# Altium project PWR_MOSFET.PrjPcb
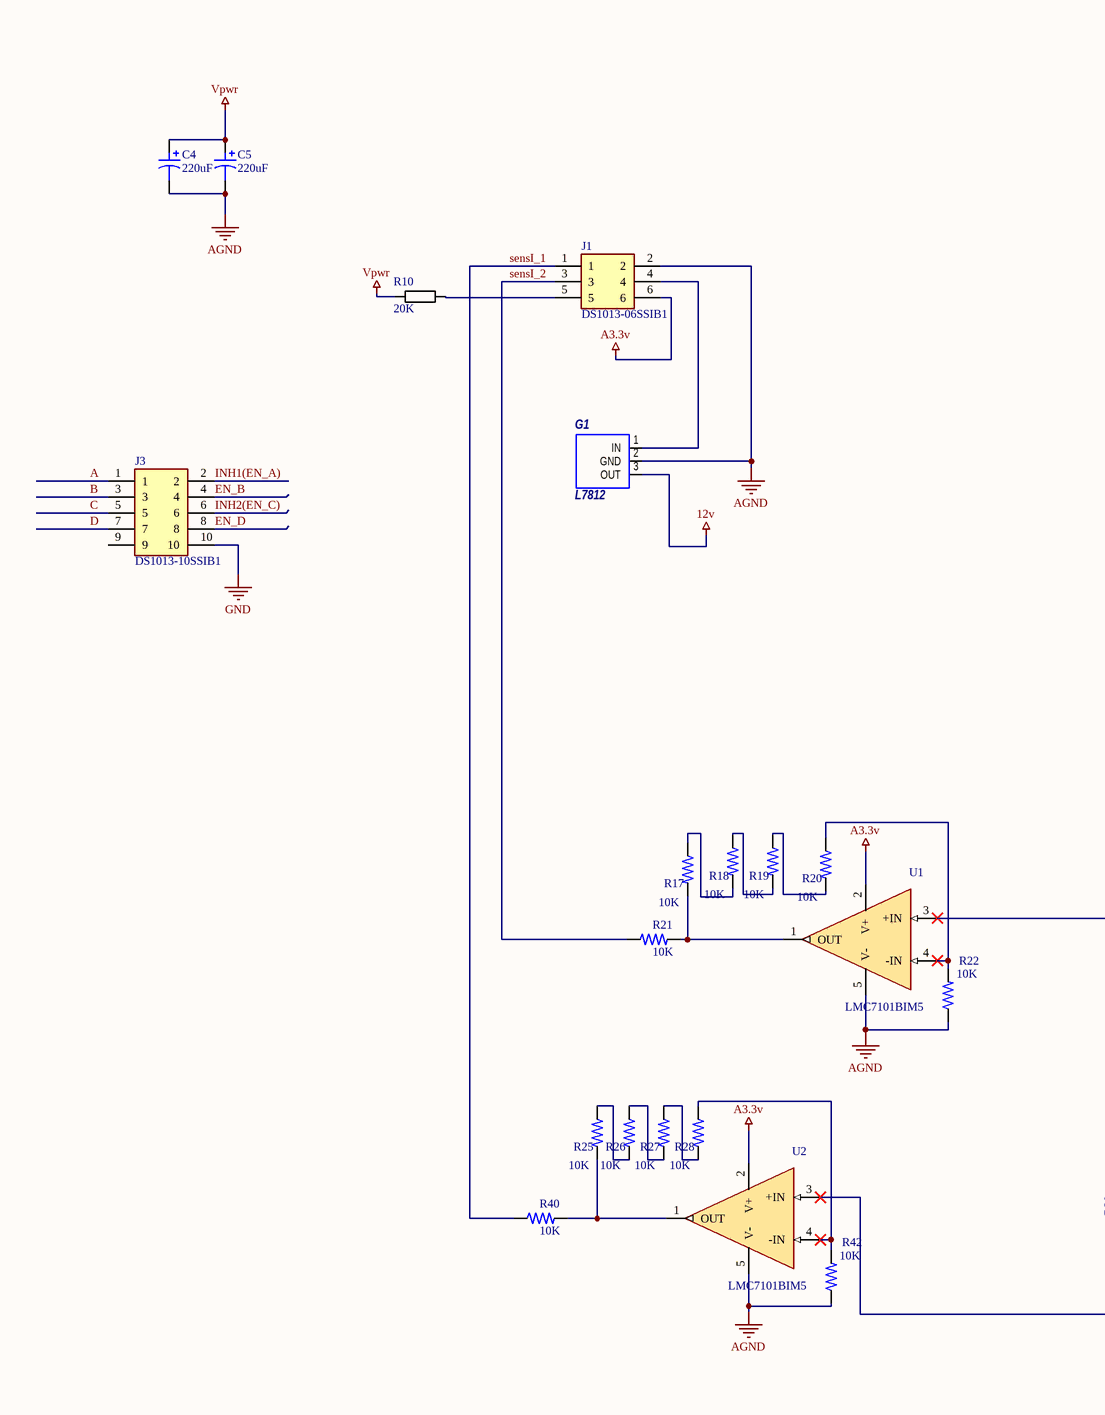
[diagram p0: PWR_MOSFET.SchDoc, left]
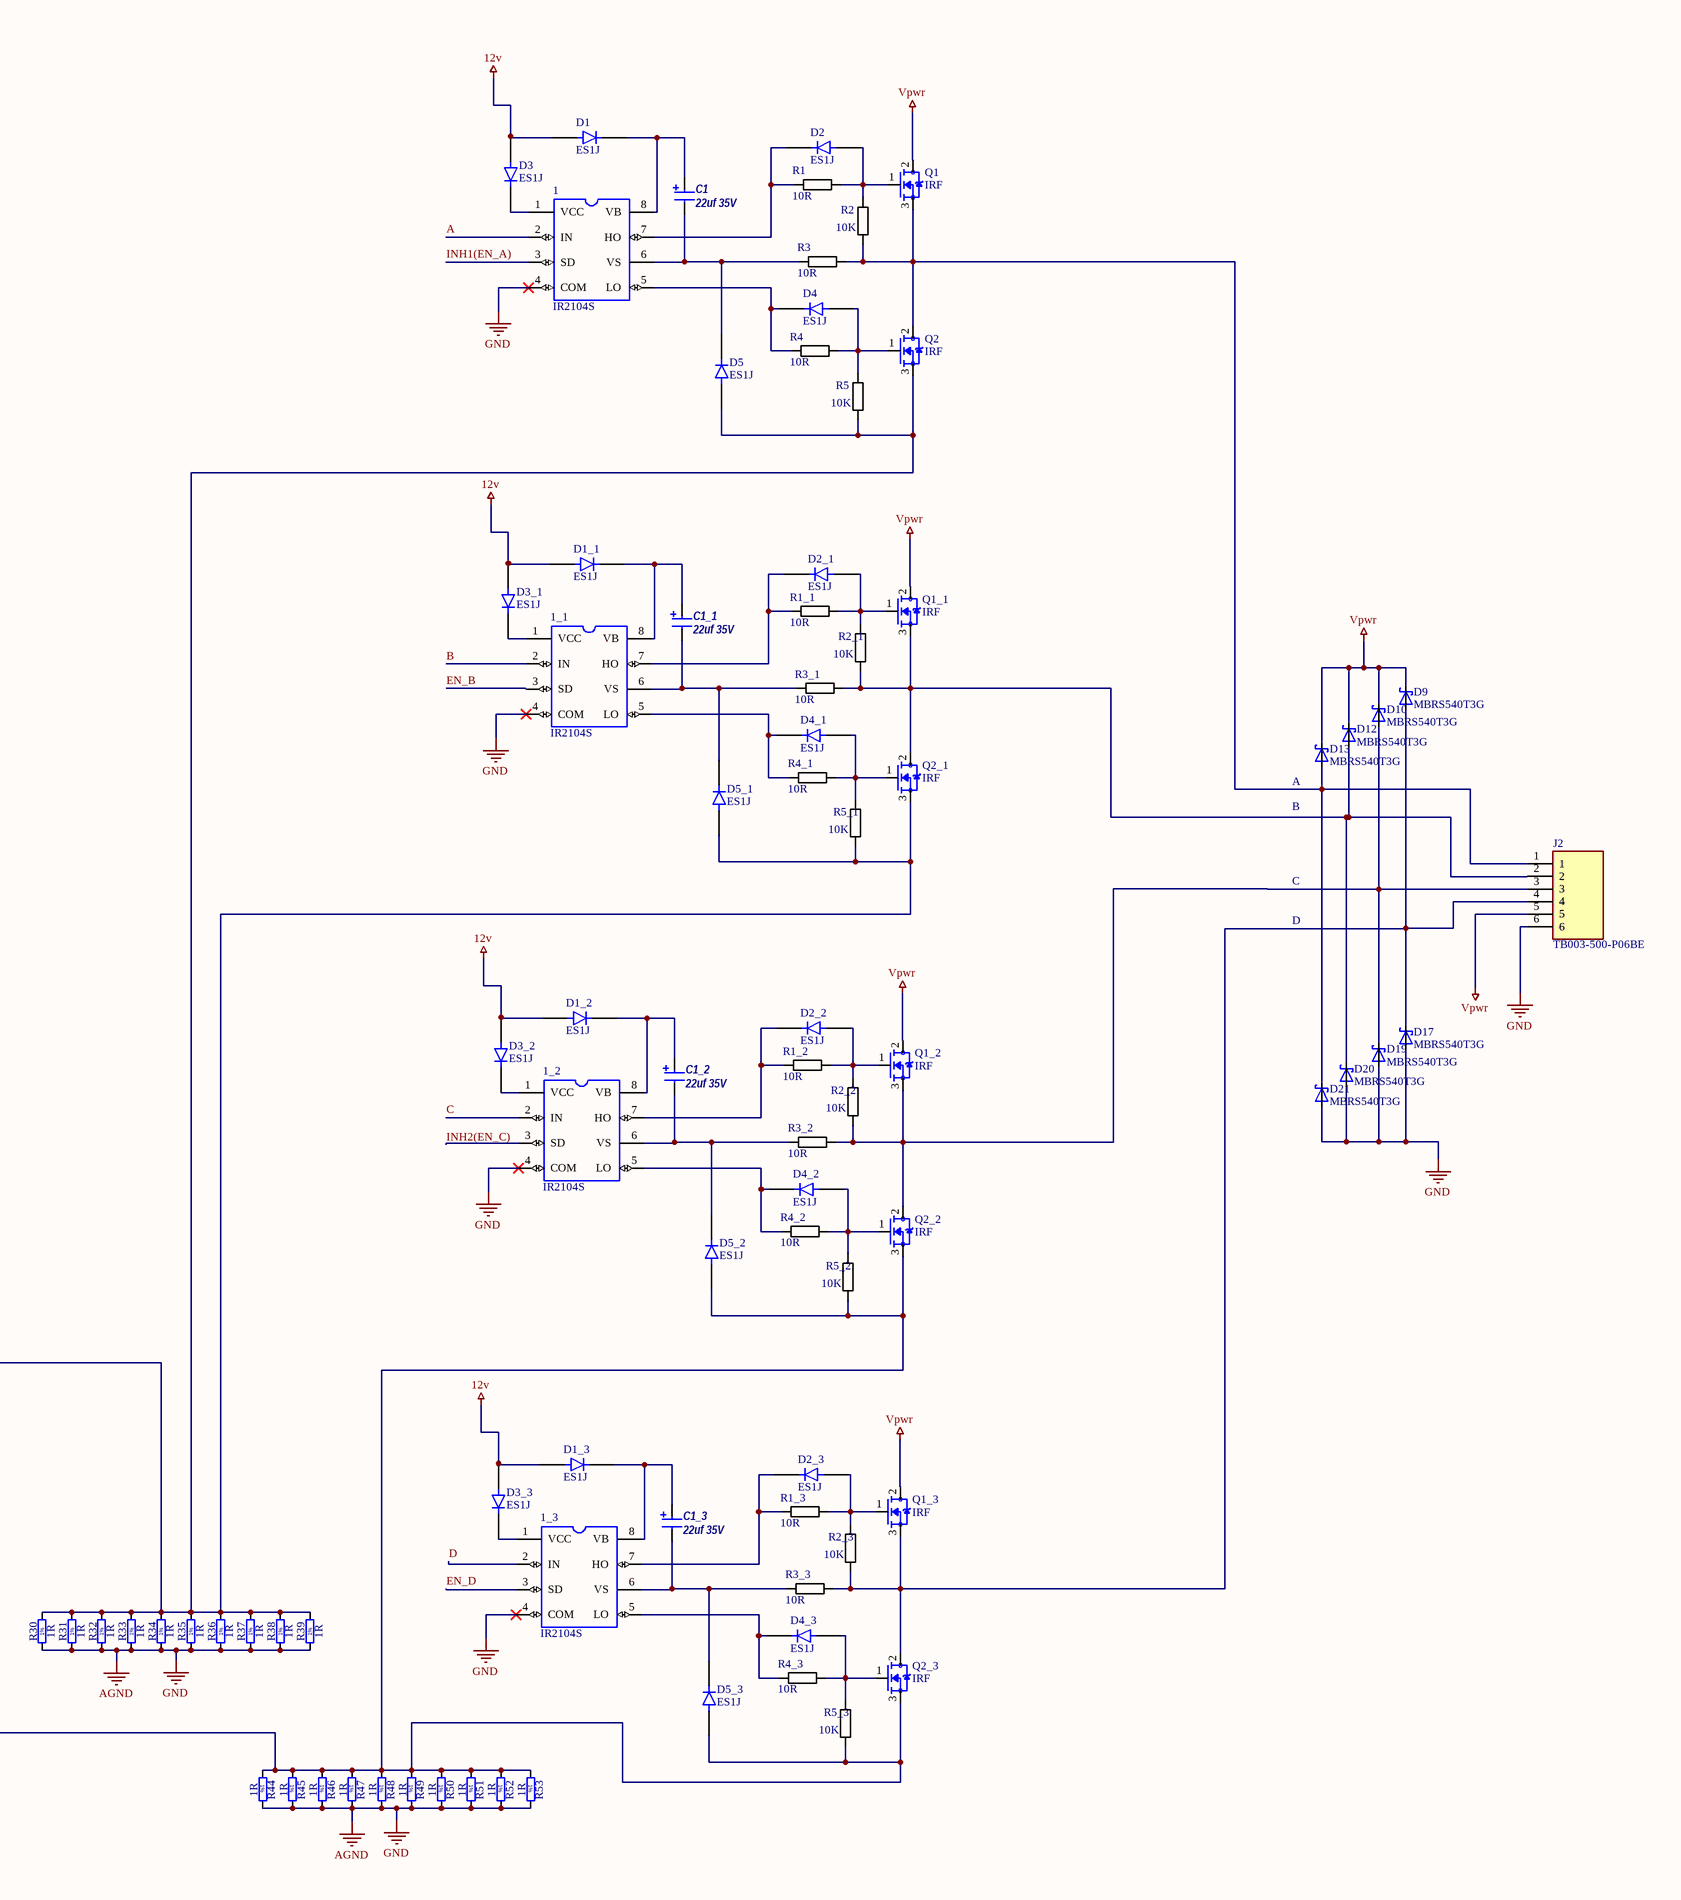
[diagram p1: PWR_MOSFET.SchDoc, right]
1 sheet, 105 parts. Net scope: global (net labels, ports and power ports of the same name join across sheets).
Board files: PWR_MOSFET_v2.PcbDoc, PWR_MOSFET.PcbDoc, PWR_MOSFET_v2.1.PcbDoc

## Sheet PWR_MOSFET.SchDoc
size A2

### Parts
1  IR2104S  [IR2104S]
1_1  IR2104S  [IR2104S]
1_2  IR2104S  [IR2104S]
1_3  IR2104S  [IR2104S]
C1  Name: 22uf 35V  [C - EL_Tantal_TYPED]  (hidden comment: {Value})
C1_1  Name: 22uf 35V  [C - EL_Tantal_TYPED]  (hidden comment: {Value})
C1_2  Name: 22uf 35V  [C - EL_Tantal_TYPED]  (hidden comment: {Value})
C1_3  Name: 22uf 35V  [C - EL_Tantal_TYPED]  (hidden comment: {Value})
C4  value 220uF  [ECR 10x13mm]  (hidden comment: 220uF 50v)
C5  value 220uF  [ECR 10x13mm]  (hidden comment: 220uF 50v)
D1  ES1J  [DIO_ES1J]
D1_1  ES1J  [DIO_ES1J]
D1_2  ES1J  [DIO_ES1J]
D1_3  ES1J  [DIO_ES1J]
D2  ES1J  [DIO_ES1J]
D2_1  ES1J  [DIO_ES1J]
D2_2  ES1J  [DIO_ES1J]
D2_3  ES1J  [DIO_ES1J]
D3  ES1J  [DIO_ES1J]
D3_1  ES1J  [DIO_ES1J]
D3_2  ES1J  [DIO_ES1J]
D3_3  ES1J  [DIO_ES1J]
D4  ES1J  [DIO_ES1J]
D4_1  ES1J  [DIO_ES1J]
D4_2  ES1J  [DIO_ES1J]
D4_3  ES1J  [DIO_ES1J]
D5  ES1J  [DIO_ES1J]
D5_1  ES1J  [DIO_ES1J]
D5_2  ES1J  [DIO_ES1J]
D5_3  ES1J  [DIO_ES1J]
D9  MBRS540T3G  [DIOM7958X213N]
D10  MBRS540T3G  [DIOM7958X213N]
D12  MBRS540T3G  [DIOM7958X213N]
D13  MBRS540T3G  [DIOM7958X213N]
D17  MBRS540T3G  [DIOM7958X213N]
D19  MBRS540T3G  [DIOM7958X213N]
D20  MBRS540T3G  [DIOM7958X213N]
D21  MBRS540T3G  [DIOM7958X213N]
G1  Name: L7812  [D2PAK_M]  (hidden comment: L7812C - V)
J1  DS1013-06SSIB1  [CONNFLY_DS1013-06SSIB1]
J2  TB003-500-P06BE  [CUI_TB003-500-P06BE]
J3  DS1013-10SSIB1  [CONNFLY_DS1013-10SSIB1]
Q1  IRF  [TO-220-KCS0003B]
Q1_1  IRF  [TO-220-KCS0003B]
Q1_2  IRF  [TO-220-KCS0003B]
Q1_3  IRF  [TO-220-KCS0003B]
Q2  IRF  [TO-220-KCS0003B]
Q2_1  IRF  [TO-220-KCS0003B]
Q2_2  IRF  [TO-220-KCS0003B]
Q2_3  IRF  [TO-220-KCS0003B]
R1  10R  [RESC2012X65N]
R1_1  10R  [RESC2012X65N]
R1_2  10R  [RESC2012X65N]
R1_3  10R  [RESC2012X65N]
R2  10K  [RESC2012X65N]
R2_1  10K  [RESC2012X65N]
R2_2  10K  [RESC2012X65N]
R2_3  10K  [RESC2012X65N]
R3  10R  [RESC2012X65N]
R3_1  10R  [RESC2012X65N]
R3_2  10R  [RESC2012X65N]
R3_3  10R  [RESC2012X65N]
R4  10R  [RESC2012X65N]
R4_1  10R  [RESC2012X65N]
R4_2  10R  [RESC2012X65N]
R4_3  10R  [RESC2012X65N]
R5  10K  [RESC2012X65N]
R5_1  10K  [RESC2012X65N]
R5_2  10K  [RESC2012X65N]
R5_3  10K  [RESC2012X65N]
R10  20K  [RESC2012X65N]
R17  10K  [RESC2012X65N]
R18  10K  [RESC2012X65N]
R19  10K  [RESC2012X65N]
R20  10K  [RESC2012X65N]
R21  10K  [RESC2012X65N]
R22  10K  [RESC2012X65N]
R25  10K  [RESC2012X65N]
R26  10K  [RESC2012X65N]
R27  10K  [RESC2012X65N]
R28  10K  [RESC2012X65N]
R30  1R  [R2512]
R31  1R  [R2512]
R32  1R  [R2512]
R33  1R  [R2512]
R34  1R  [R2512]
R35  1R  [R2512]
R36  1R  [R2512]
R37  1R  [R2512]
R38  1R  [R2512]
R39  1R  [R2512]
R40  10K  [RESC2012X65N]
R42  10K  [RESC2012X65N]
R44  1R  [R2512]
R45  1R  [R2512]
R46  1R  [R2512]
R47  1R  [R2512]
R48  1R  [R2512]
R49  1R  [R2512]
R50  1R  [R2512]
R51  1R  [R2512]
R52  1R  [R2512]
R53  1R  [R2512]
U1  LMC7101BIM5  [*SOT95P280X145-5N]
U2  LMC7101BIM5  [*SOT95P280X145-5N]

### Nets
12v: D1.A D1_1.A D1_2.A D1_3.A D3.A D3_1.A D3_2.A D3_3.A G1.3(OUT)
A3.3v: J1.6 U1.2(V+) U2.2(V+)
AGND: 1.4(COM) 1_1.4(COM) 1_2.4(COM) 1_3.4(COM) C4.2 C5.2 D17.A D19.A D20.A D21.A G1.2(GND) J1.2 J2.6 J3.10 R22.1 R30.1 R31.1 R32.1 R33.1 R34.1 R35.1 R36.1 R37.1 R38.1 R39.1 R42.1 R44.2 R45.2 R46.2 R47.2 R48.2 R49.2 R50.2 R51.2 R52.2 R53.2 U1.5(V-) U2.5(V-)  [also labelled GND]
Vpwr: C4.1 C5.1 D9.C D10.C D12.C D13.C J2.5 Q1.2(D) Q1_1.2(D) Q1_2.2(D) Q1_3.2(D) R10.1
A: 1.2(IN) J3.1
B: 1_1.2(IN) J3.3
C: 1_2.2(IN) J3.5
D: 1_3.2(IN) J3.7
EN_B: 1_1.3(SD) J3.4
EN_D: 1_3.3(SD) J3.8
INH1(EN_A): 1.3(SD) J3.2
INH2(EN_C): 1_2.3(SD) J3.6
sensI_1: J1.1 R40.1
sensI_2: J1.3 R21.1
Net1_1: 1.1(VCC) D3.K
Net1_1_1: 1_1.1(VCC) D3_1.K
Net1_1_5: 1_1.5(LO) D4_1.K R4_1.1
Net1_1_6: 1_1.6(VS) C1_1.2 D5_1.K R3_1.1
Net1_1_7: 1_1.7(HO) D2_1.K R1_1.1
Net1_1_8: 1_1.8(VB) C1_1.1 D1_1.K
Net1_2_1: 1_2.1(VCC) D3_2.K
Net1_2_5: 1_2.5(LO) D4_2.K R4_2.1
Net1_2_6: 1_2.6(VS) C1_2.2 D5_2.K R3_2.1
Net1_2_7: 1_2.7(HO) D2_2.K R1_2.1
Net1_2_8: 1_2.8(VB) C1_2.1 D1_2.K
Net1_3_1: 1_3.1(VCC) D3_3.K
Net1_3_5: 1_3.5(LO) D4_3.K R4_3.1
Net1_3_6: 1_3.6(VS) C1_3.2 D5_3.K R3_3.1
Net1_3_7: 1_3.7(HO) D2_3.K R1_3.1
Net1_3_8: 1_3.8(VB) C1_3.1 D1_3.K
Net1_5: 1.5(LO) D4.K R4.1
Net1_6: 1.6(VS) C1.2 D5.K R3.1
Net1_7: 1.7(HO) D2.K R1.1
Net1_8: 1.8(VB) C1.1 D1.K
NetD2_1_A: D2_1.A Q1_1.1(G) R1_1.2 R2_1.1
NetD2_2_A: D2_2.A Q1_2.1(G) R1_2.2 R2_2.1
NetD2_3_A: D2_3.A Q1_3.1(G) R1_3.2 R2_3.1
NetD2_A: D2.A Q1.1(G) R1.2 R2.1
NetD4_1_A: D4_1.A Q2_1.1(G) R4_1.2 R5_1.1
NetD4_2_A: D4_2.A Q2_2.1(G) R4_2.2 R5_2.1
NetD4_3_A: D4_3.A Q2_3.1(G) R4_3.2 R5_3.1
NetD4_A: D4.A Q2.1(G) R4.2 R5.1
NetD5_2_A: D5_2.A D5_3.A Q2_2.3(S) Q2_3.3(S) R5_2.2 R5_3.2 R44.1 R45.1 R46.1 R47.1 R48.1 R49.1 R50.1 R51.1 R52.1 R53.1 U2.3(+IN)
NetD5_A: D5.A D5_1.A Q2.3(S) Q2_1.3(S) R5.2 R5_1.2 R30.2 R31.2 R32.2 R33.2 R34.2 R35.2 R36.2 R37.2 R38.2 R39.2 U1.3(+IN)
NetD9_A: D9.A D17.C J2.4 Q1_3.3(S) Q2_3.2(D) R2_3.2 R3_3.2
NetD10_A: D10.A D19.C J2.3 Q1_2.3(S) Q2_2.2(D) R2_2.2 R3_2.2
NetD12_A: D12.A D20.C J2.2 Q1_1.3(S) Q2_1.2(D) R2_1.2 R3_1.2
NetD13_A: D13.A D21.C J2.1 Q1.3(S) Q2.2(D) R2.2 R3.2
NetG1_1: G1.1(IN) J1.4
NetJ1_5: J1.5 R10.2
NetR17_1: R17.1 R18.2
NetR17_2: R17.2 R21.2 U1.1(OUT)
NetR18_1: R18.1 R19.2
NetR19_1: R19.1 R20.2
NetR20_1: R20.1 R22.2 U1.4(-IN)
NetR25_1: R25.1 R26.2
NetR25_2: R25.2 R40.2 U2.1(OUT)
NetR26_1: R26.1 R27.2
NetR27_1: R27.1 R28.2
NetR28_1: R28.1 R42.2 U2.4(-IN)

Not connected (* = marked no-connect by the designer): J3 9

### Notes on the sheet
- (near D13) A
- B
- C
- D
- (in symbol Resistor - 1%) 1%

### Library data of the parts
1 1_1-1_3 = IR2104S: Half-Bridge Gate Driver IC Non-Inverting 8-SOIC; MF: Infineon Technologies; SnapEDA_Link: https://www.snapeda.com/parts/IR2104S/Infineon%20Technologies/view-part/582439/?ref=snap; Package: SO-8 Infineon; MP: IR2104S; Price: None; Value: *; Availability: Unavailable
C1 C1_1-C1_3 = C - EL_Tantal_SMD_TypeD: Конденсатор электролитический танталовый TypeD; Indication: {Indication}; Value: {Value}
C4 C5 = Cap Pol: Polarized Capacitor (Rad); Voltage: 50; Type: Type; URL: http://www.hitano.com.tw/PDF/ECR_081225.pdf
D1 D1_1-D1_3 D2 D2_1-D2_3 D3 D3_1-D3_3 D4 D4_1-D4_3 D5 D5_1-D5_3 = ES1J: Diode Standard 600V 1A Surface Mount SMA (DO-214AC); MF: ON Semiconductor; Arrow_Electronics-Purchase-URL: https://snapeda.com/shop?store=Arrow+Electronics&id=1637442; DigiKey-Purchase-URL: https://snapeda.com/shop?store=DigiKey&id=1637442; Package: SMA-2 ON Semiconductor; Availability: Good; SnapEDA_Link: https://www.snapeda.com/parts/ES1J/ON%20Semiconductor/view-part/1637442/?ref=snap; MP: ES1J; Mouser-Purchase-URL: https://snapeda.com/shop?store=Mouser&id=1637442; Value: *; Price: None; BuyPart: https://www.snapeda.com/parts/ES1J/ON%20Semiconductor/view-part/1637442/?ref=eda
D9 D10 D12 D13 D17 D19-D21 = MBRS540T3G: Diode Schottky 40V 5A Surface Mount SMC; MF: ON Semiconductor; SnapEDA_Link: https://www.snapeda.com/parts/MBRS540T3G/ON%20Semiconductor/view-part/78777/?ref=snap; MP: MBRS540T3G; Availability: Unavailable; Price: None; Value: *; Package: DO-214 ON Semiconductor
G1 = G - L7812: Линейный стабилизатор 12В 0,5А; Indication: {Indication}; Value: L7812C - V
J1 = DS1013-06SSIB1: Socket; IDC; male; PIN: 6; straight; THT; gold plated; 2.54mm
J2 = TB003-500-P06BE: 2~24 Poles, Screw Type, Horizontal, 5.0 Pitch, 26~14 _AWG_, Terminal Block Connector; MF: CUI Devices; Value: *; Price: None; MP: TB003-500-P06BE; SnapEDA_Link: https://www.snapeda.com/parts/TB003-500-P06BE/CUI%20Devices/view-part/3590657/?ref=snap; Package: None; Availability: Unavailable
J3 = DS1013-10SSIB1: Socket; IDC; male; PIN: 10; straight; THT; gold plated; 2.54mm; MF: Connfly; Availability: Unavailable; Price: None; Package: None; Value: *; SnapEDA_Link: https://www.snapeda.com/parts/DS1013-10SSIB1/Connfly/view-part/951223/?ref=snap; MP: DS1013-10SSIB1; BuyPart: https://www.snapeda.com/parts/DS1013-10SSIB1/Connfly/view-part/951223/?ref=eda
Q1 Q1_1-Q1_3 Q2 Q2_1-Q2_3 = IRF: N-Channel Power Transistor - TO-220; MP: IPP037N06L3_G; Package: None; Price: None; Value: *; Availability: Unavailable
R1 R1_1-R1_3 R2 R2_1-R2_3 R3 R3_1-R3_3 R4 R4_1-R4_3 R5 R5_1-R5_3 R10 = Resistor: Value: *
R17-R22 R25-R28 R40 R42 = 8-1879343-8: Res Thin Film 0805 10K Ohm 1% 0.1W(1/10W) Â±50ppm/C Epoxy Pad SMD T/R; Power_Rating: .1 W; MF: TE Connectivity; Voltage_Rating: 100 V; Value: *; Price: None; SnapEDA_Link: https://www.snapeda.com/parts/8-1879343-8/TE%20Connectivity/view-part/2208734/?ref=snap; Resistance: 10K; EU_RoHS_Compliance: Compliant; Tolerance: 1%; Availability: Warning; MP: 8-1879343-8; Check_prices: https://www.snapeda.com/parts/8-1879343-8/TE%20Connectivity/view-part/2208734/?ref=eda; Package: 0805
R30-R39 R44-R53 = Resistor - 1%
U1 U2 = LMC7101BIM5: Check_prices: https://www.snapeda.com/parts/LMC7101BIM5/Texas%20Instruments/view-part/19255/?ref=eda; SnapEDA_Link: https://www.snapeda.com/parts/LMC7101BIM5/Texas%20Instruments/view-part/19255/?ref=snap; Value: *